# Altium project shkb_lite.PrjPcb
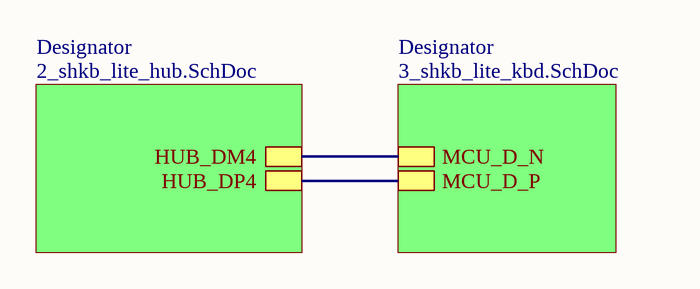
[diagram p0: 1_shkb_lite_top.SchDoc]
ProjectTitle: SHKB Lite; Revision: A3
3 sheets, 73 parts. Net scope: hierarchical (ports join the sheet entries above them; power ports are global).
Board file: shkb_lite.PcbDoc
Sheets:
  1_shkb_lite_top.SchDoc
    Designator = 2_shkb_lite_hub.SchDoc
    Designator = 3_shkb_lite_kbd.SchDoc

## Sheet 1_shkb_lite_top.SchDoc: =ProjectTitle
size A4; Address1: github.com/4pplet/SHKB; Address2: Licence: CERN-OHL-S; Revision: A3; SheetNumber: 1; SheetTotal: 3

### Sub-sheets
Designator = 2_shkb_lite_hub.SchDoc: HUB_DM4, HUB_DP4
Designator = 3_shkb_lite_kbd.SchDoc: MCU_D_P, MCU_D_N

### Nets
D4_N: sheet Designator/HUB_DM4, sheet Designator/MCU_D_N
D4_P: sheet Designator/HUB_DP4, sheet Designator/MCU_D_P

### Notes on the sheet
- Title
- Size:
- Date:
- A4
- Number:
- Time:
- Revision:
- Sheet
- of
- File:

## Sheet 2_shkb_lite_hub.SchDoc: =ProjectTitle
size A4; Address1: github.com/4pplet/SHKB; Address2: Licence: CERN-OHL-S; Revision: A3; SheetNumber: 2; SheetTotal: 7
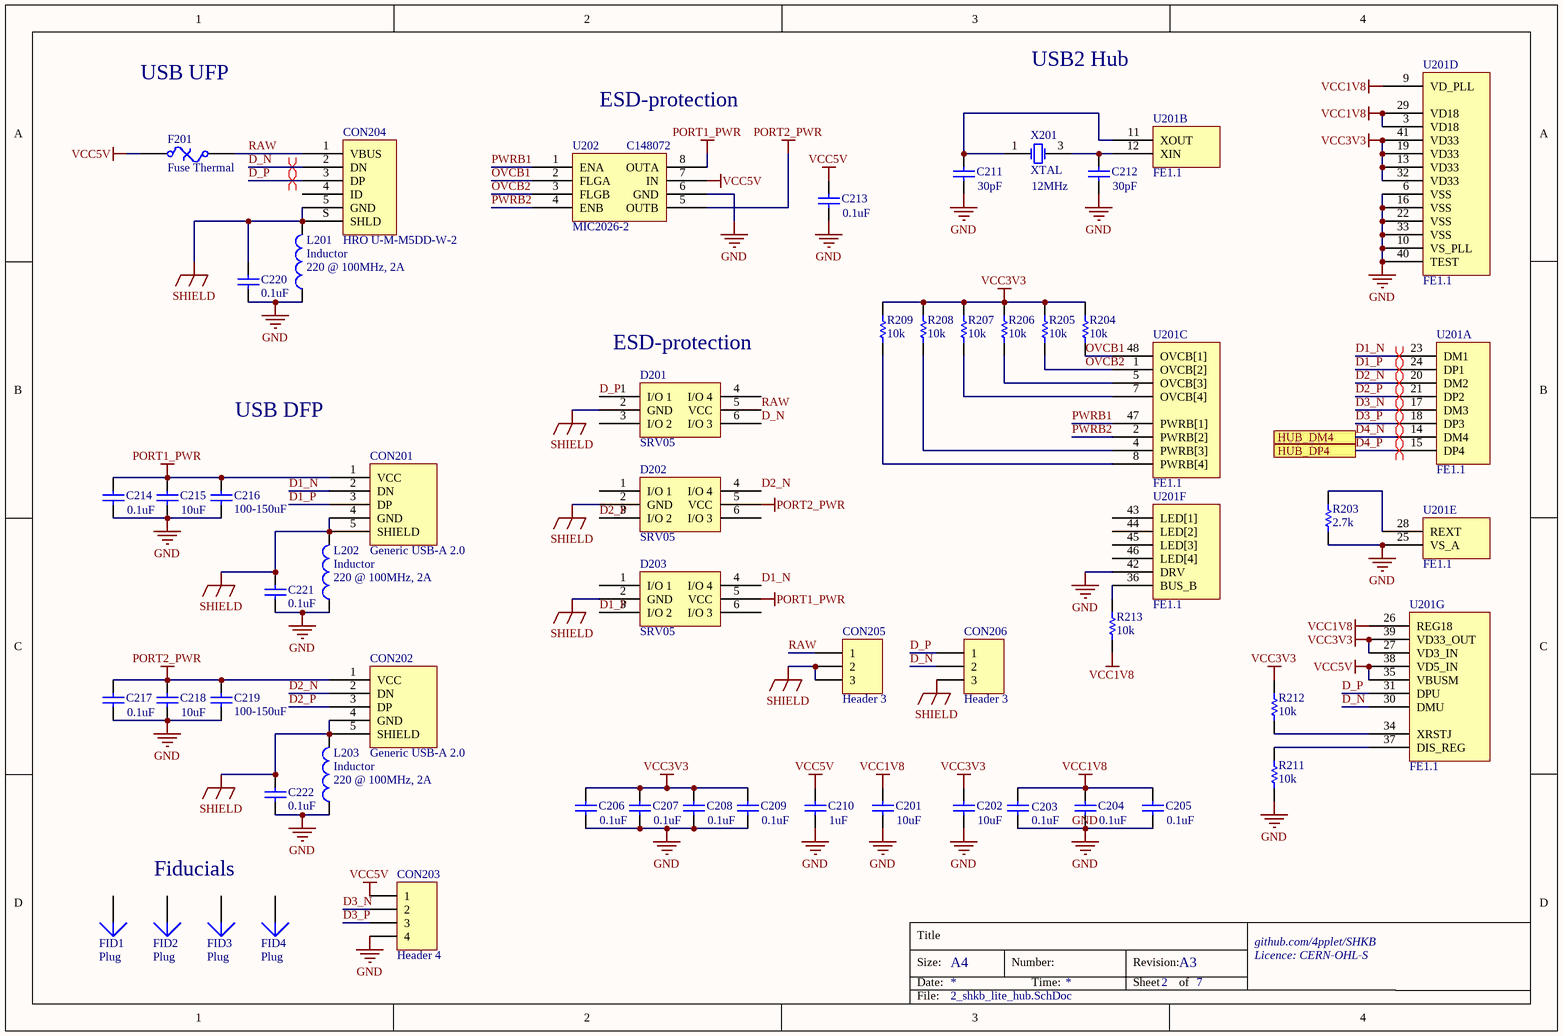
[diagram p1: 2_shkb_lite_hub.SchDoc]

### Parts
C201  value 10uF  [C0603[1608]]
C202  value 10uF  [C0603[1608]]
C203  value 0.1uF  [C0603[1608]]
C204  value 0.1uF  [C0603[1608]]
C205  value 0.1uF  [C0603[1608]]
C206  value 0.1uF  [C0603[1608]]
C207  value 0.1uF  [C0603[1608]]
C208  value 0.1uF  [C0603[1608]]
C209  value 0.1uF  [C0603[1608]]
C210  value 1uF  [C0603[1608]]
C211  value 30pF  [C0603[1608]]
C212  value 30pF  [C0603[1608]]
C213  value 0.1uF  [C0603[1608]]
C214  value 0.1uF  [C0603[1608]]
C215  value 10uF  [C0603[1608]]
C216  value 100-150uF  [C_9L_9M + THT]
C217  value 0.1uF  [C0603[1608]]
C218  value 10uF  [C0603[1608]]
C219  value 100-150uF  [C_9L_9M + THT]
C220  value 0.1uF  [C0603[1608]]
C221  value 0.1uF  [C0603[1608]]
C222  value 0.1uF  [C0603[1608]]
CON201  Generic USB-A 2.0  [Jing 903-231A2031S10100]
CON202  Generic USB-A 2.0  [Jing 903-231A2031S10100]
CON203  Header 4  [HDR1X4]  (no BOM)
CON204  HRO U-M-M5DD-W-2  [HRO U-M-M5DD-W-2]
CON205  Header 3  [HDR1X3]  (no BOM)
CON206  Header 3  [HDR1X3]  (no BOM)
D201  SRV05  [SOT-23-6]
D202  SRV05  [SOT-23-6]
D203  SRV05  [SOT-23-6]
F201  Fuse Thermal  [C1206[3216]]
FID1  Plug  [Fiducial_Nordic]  (no BOM)
FID2  Plug  [Fiducial_Nordic]  (no BOM)
FID3  Plug  [Fiducial_Nordic]  (no BOM)
FID4  Plug  [Fiducial_Nordic]  (no BOM)
L201  Inductor  value 220 @ 100MHz, 2A  [L0603[1608]]
L202  Inductor  value 220 @ 100MHz, 2A  [L0603[1608]]
L203  Inductor  value 220 @ 100MHz, 2A  [L0603[1608]]
R203  value 2.7k  [R0603[1608]]
R204  value 10k  [R0603[1608]]
R205  value 10k  [R0603[1608]]
R206  value 10k  [R0603[1608]]
R207  value 10k  [R0603[1608]]
R208  value 10k  [R0603[1608]]
R209  value 10k  [R0603[1608]]
R211  value 10k  [R0603[1608]]
R212  value 10k  [R0603[1608]]
R213  value 10k  [R0603[1608]]
U201  FE1.1  [FE1.1 LQFP48]  (parts A,B,C,D,E,F,G of 7)
U202  MIC2026-2  [SOIC-8]
X201  XTAL  value 12MHz  [XTAL-3225]

### Ports
HUB_DM4, HUB_DP4

### Nets
GND: C201.1 C202.1 C203.1 C204.1 C205.1 C206.1 C207.1 C208.1 C209.1 C210.1 C211.1 C212.1 C213.1 C214.1 C215.1 C216.2 C217.1 C218.1 C219.2 C220.1 C221.1 C222.1 CON203.4 L201.1 L202.1 L203.1 R203.1 R211.1 U201.6(VSS) U201.10(VS_PLL) U201.16(VSS) U201.22(VSS) U201.25(VS_A) U201.33(VSS) U201.40(TEST) U201.42(DRV) U202.6(GND) X201.2(GND) X201.4(GND)
PORT1_PWR: C214.2 C215.2 C216.1 CON201.1(VCC) D203.5(VCC) U202.8(OUTA)
PORT2_PWR: C217.2 C218.2 C219.1 CON202.1(VCC) D202.5(VCC) U202.5(OUTB)
SHIELD: C220.2 C221.2 C222.2 CON201.4(GND) CON201.5(SHIELD) CON202.4(GND) CON202.5(SHIELD) CON204.5(GND) CON204.S(SHLD) CON205.2 CON205.3 CON206.3 D201.2(GND) D202.2(GND) D203.2(GND) L201.2 L202.2 L203.2
VCC1V8: C201.2 C203.2 C204.2 C205.2 R213.1 U201.3(VD18) U201.9(VD_PLL) U201.26(REG18) U201.29(VD18)
VCC3V3: C202.2 C206.2 C207.2 C208.2 C209.2 R204.2 R205.2 R206.2 R207.2 R208.2 R209.2 R212.2 U201.13(VD33) U201.19(VD33) U201.27(VD3_IN) U201.32(VD33) U201.39(VD33_OUT) U201.41(VD33)
VCC5V: C210.2 C213.2 CON203.1 F201.1 U201.35(VBUSM) U201.38(VD5_IN) U202.7(IN)
D1_N: CON201.2(DN) D203.4(I/O_4) U201.23(DM1)
D1_P: CON201.3(DP) D203.3(I/O_2) U201.24(DP1)
D2_N: CON202.2(DN) D202.4(I/O_4) U201.20(DM2)
D2_P: CON202.3(DP) D202.3(I/O_2) U201.21(DP2)
D3_N: CON203.2 U201.17(DM3)
D3_P: CON203.3 U201.18(DP3)
D4_N: U201.14(DM4) ; port HUB_DM4
D4_P: U201.15(DP4) ; port HUB_DP4
D_N: CON204.2(DN) CON206.2 D201.6(I/O_3) U201.30(DMU)
D_P: CON204.3(DP) CON206.1 D201.1(I/O_1) U201.31(DPU)
OVCB1: R204.1 U201.48(OVCB[1]) U202.2(FLGA)
OVCB2: R205.1 U201.1(OVCB[2]) U202.3(FLGB)
PWRB1: U201.47(PWRB[1]) U202.1(ENA)
PWRB2: U201.2(PWRB[2]) U202.4(ENB)
RAW: CON204.1(VBUS) CON205.1 D201.5(VCC) F201.2
NetC211_2: C211.2 U201.11(XOUT) X201.1(OSC1)
NetC212_2: C212.2 U201.12(XIN) X201.3(OSC2)
NetR203_2: R203.2 U201.28(REXT)
NetR206_1: R206.1 U201.5(OVCB[3])
NetR207_1: R207.1 U201.7(OVCB[4])
NetR208_1: R208.1 U201.4(PWRB[3])
NetR209_1: R209.1 U201.8(PWRB[4])
NetR211_2: R211.2 U201.37(DIS_REG)
NetR212_1: R212.1 U201.34(XRSTJ)
NetR213_2: R213.2 U201.36(BUS_B)

Not connected (* = marked no-connect by the designer): CON204 4(ID); D201 3(I/O_2) 4(I/O_4); D202 1(I/O_1) 6(I/O_3); D203 1(I/O_1) 6(I/O_3); FID1 1; FID2 1; FID3 1; FID4 1; U201 43(LED[1]) 44(LED[2]) 45(LED[3]) 46(LED[4])

### Layout directives
differential pair: D1_N, D1_P, D2_N, D2_P, D3_N, D3_P, D4_N, D4_P, D_N, D_P

### Notes on the sheet
- USB UFP
- ESD-protection
- USB2 Hub
- (near U202) C148072
- (near D201) ESD-protection
- USB DFP
- Fiducials
- Title
- Size:
- Date:
- A4
- Number:
- Time:
- Revision:
- Sheet
- of
- File:

### Library data of the parts
C201 C202 C215 C218 = Cap: Capacitor; MRF.Part: CL10A106KP8NNNC; LCSC MFG: Samsung Electro-Mechanics; Version: 0603 imperial; JLC: BASIC; LCSC Part #: C19702
C203-C209 C213 C214 C217 C220-C222 = Cap: Capacitor; MRF.Part: CC0603KRX7R9BB104; MFG: KEMET; MFGPN: C0603C104M5RACTU; LCSC MFG: YAGEO; Version: 0603 imperial; JLC: BASIC; LCSC Part #: C14663
C210 = Cap: Capacitor; MRF.Part: CL10A105KB8NNNC; MFG: KEMET; MFGPN: C0603C105K4RACTU; LCSC MFG: Samsung Electro-Mechanics; Version: 0603 imperial; JLC: BASIC; LCSC Part #: C15849
C211 C212 = Cap: Capacitor; MRF.Part: 0603CG300J500NT; LCSC MFG: FH (Guangdong Fenghua Advanced Tech); Version: 0603 imperial; JLC: BASIC; LCSC Part #: C1658
C216 C219 = Cap: Capacitor; MRF.Part: OVZ101M1CTR-0606; LCSC MFG: Lelon; Version: SMD - 9L or 9M; JLC: EXTENDED; LCSC Part #: C134878
CON201 CON202 = Generic USB-A 2.0: MRF.Part: 903-231A2031S10100; LCSC MFG: Jing Extension of the Electronic Co.; JLC: EXTENDED; LCSC Part #: C42646
CON203 = Header 4: Header, 4-Pin
CON204 = HRO U-M-M5DD-W-2: LCSC MFG: Korean Hroparts Elec; LCSC Part #: C879746; MRF.Part: U-M-M5DD-W-2
CON205 CON206 = Header 3: Header, 3-Pin
D201-D203 = SRV05: MRF.Part: SRV05-4-P-T7; LCSC MFG: ProTek Devices; LCSC Part #: C85364; JLC: BASIC
F201 = Fuse Thermal: Thermal Fuse; MRF.Part: ASMD1206-050; MFG: Bel Fuse Inc.; MFGPN: 0ZCJ0050FF2G; LCSC MFG: Shenzhen JDT Fuse; LCSC Part #: C135338
L201-L203 = Inductor: MRF.Part: BLM18KG331SN1D; MFG: Murata Electronics North America; MFGPN: BLM18KG221SN1D; LCSC MFG: Murata Electronics; Version: 0603 imperial; JLC: EXTENDED; LCSC Part #: C85832
R203 = Res1: Resistor; MRF.Part: 0603WAF2701T5E; LCSC MFG: UNI-ROYAL(Uniroyal Elec); Version: 0603 imperial; JLC: BASIC; LCSC Part #: C13167
R204-R209 R211-R213 = Res1: Resistor; MRF.Part: 0603WAF1002T5E; MFG: Vishay Dale; MFGPN: RCA060310K0FKEA; LCSC MFG: Uniroyal Elec; Version: 0603 imperial; JLC: BASIC; LCSC Part #: C25804
U201 = FE1.1: LCSC MFG: Terminus Tech; JLC: EXTENDED; LCSC Part #: C28958; MRF.Part: FE1.1
U202 = MIC2026-2: MRF.Part: MIC2026-2YM-TR; LCSC MFG: Microchip Tech; JLC: EXTENDED; LCSC Part #: C148072
X201 = XTAL: Crystal Oscillator; MRF.Part: X322512MSB4SI; LCSC MFG: Yangxing Tech; LCSC Part #: C9002; JLC: BASIC
FID1-FID4 = Plug: JLC: DNP

## Sheet 3_shkb_lite_kbd.SchDoc: =ProjectTitle
size A4; Address1: github.com/4pplet/SHKB; Address2: Licence: CERN-OHL-S; Revision: A3; SheetNumber: 3; SheetTotal: 3
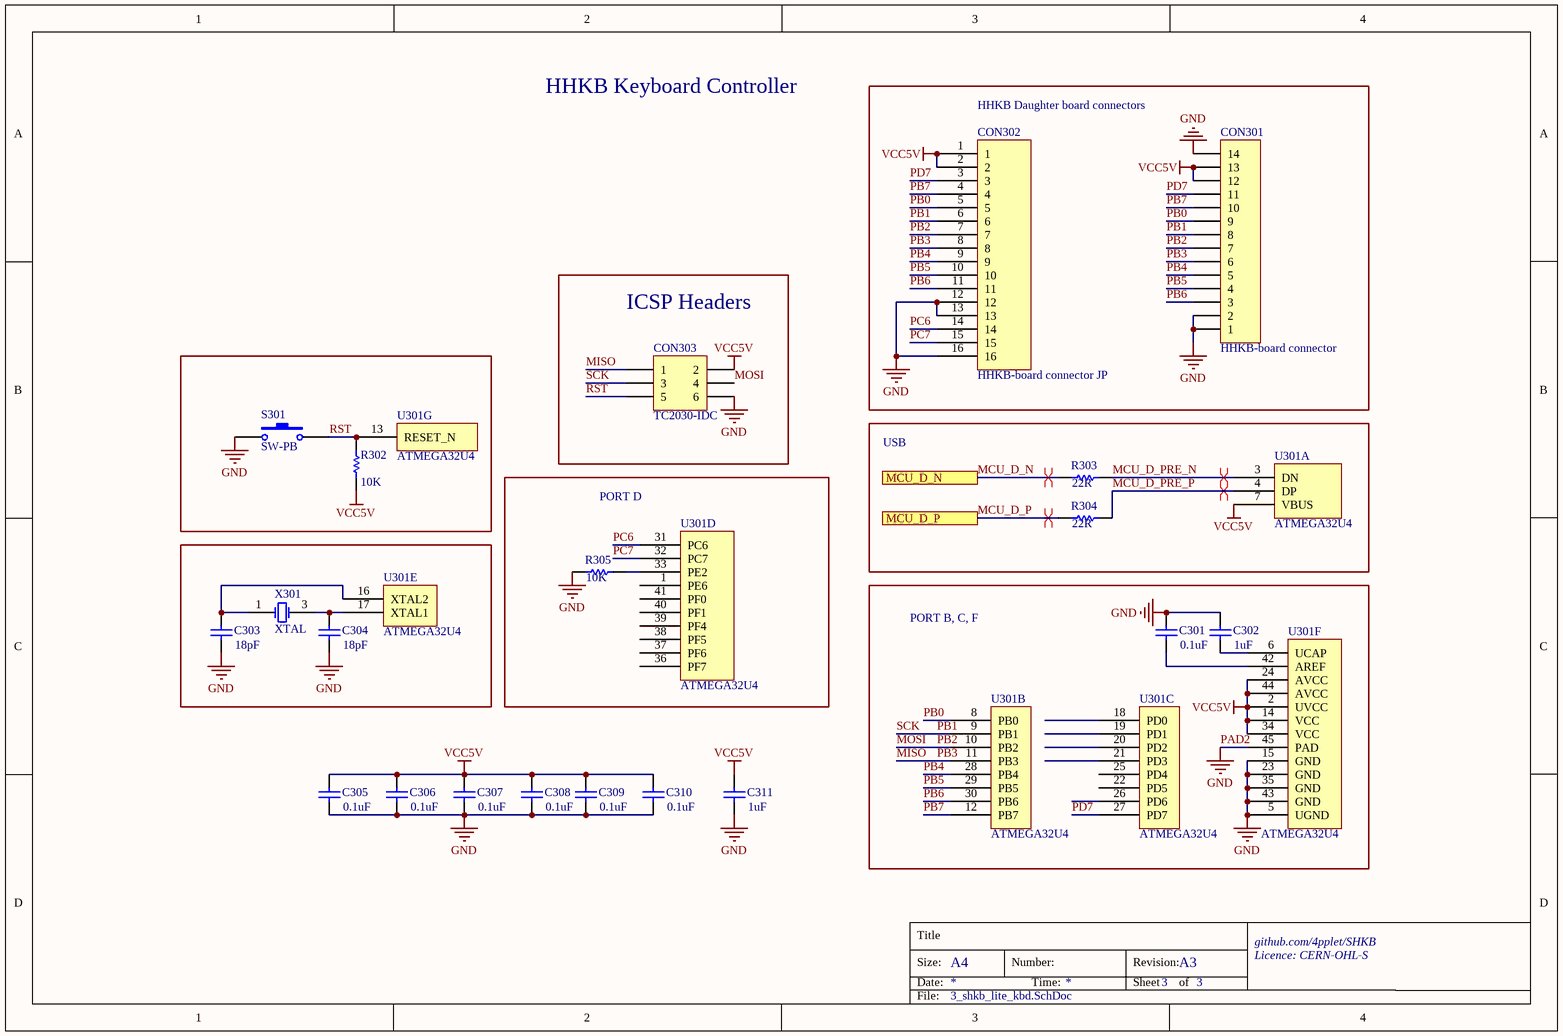
[diagram p2: 3_shkb_lite_kbd.SchDoc]

### Parts
C301  value 0.1uF  [C0603[1608]]
C302  value 1uF  [C0603[1608]]
C303  value 18pF  [C0603[1608]]
C304  value 18pF  [C0603[1608]]
C305  value 0.1uF  [C0603[1608]]
C306  value 0.1uF  [C0603[1608]]
C307  value 0.1uF  [C0603[1608]]
C308  value 0.1uF  [C0603[1608]]
C309  value 0.1uF  [C0603[1608]]
C310  value 0.1uF  [C0603[1608]]
C311  value 1uF  [C0603[1608]]
CON301  HHKB-board connector  [JST S13B-ZR-SM4A-TF(LF)(SN)]
CON302  HHKB-board connector JP  [DF14A-15P-1.25H]  (no BOM)
CON303  TC2030-IDC  [TC2030-IDC-NL]  (no BOM)
R302  value 10K  [R0603[1608]]
R303  value 22R  [R0603[1608]]
R304  value 22R  [R0603[1608]]
R305  value 10K  [R0603[1608]]
S301  SW-PB  [Wurth 431256038736]
U301  ATMEGA32U4  [ATMEGA32U4-COMBO]  (parts A,B,C,D,E,F,G of 7)
X301  XTAL  [XTAL-3225]

### Blocks framed on the sheet
HHKB Daughter board connectors: CON301 CON302
ICSP Headers: CON303
USB: R303 R304 U301
PORT D: R305 U301
PORT B, C, F: C301 C302 U301

### Ports
MCU_D_N, MCU_D_P

### Nets
GND: C301.2 C302.2 C303.1 C304.1 C305.1 C306.1 C307.1 C308.1 C309.1 C310.1 C311.1 CON301.1 CON301.2 CON301.14 CON302.12 CON302.13 CON302.16 CON303.6 R305.1 S301.2 S301.3(GND) U301.5(UGND) U301.15(GND) U301.23(GND) U301.35(GND) U301.43(GND) U301.45(PAD) X301.2(GND) X301.4(GND)  [also labelled PAD2]
VCC5V: C305.2 C306.2 C307.2 C308.2 C309.2 C310.2 C311.2 CON301.12 CON301.13 CON302.1 CON302.2 CON303.2 R302.2 U301.2(UVCC) U301.7(VBUS) U301.14(VCC) U301.24(AVCC) U301.34(VCC) U301.44(AVCC)
MCU_D_N: R303.1 ; port MCU_D_N  [project net D4_N]
MCU_D_P: R304.1 ; port MCU_D_P  [project net D4_P]
MCU_D_PRE_N: R303.2 U301.3(DN)
MCU_D_PRE_P: R304.2 U301.4(DP)
MISO: CON301.6 CON302.8 CON303.1 U301.11(PB3)  [also labelled PB3]
MOSI: CON301.7 CON302.7 CON303.4 U301.10(PB2)  [also labelled PB2]
PB0: CON301.9 CON302.5 U301.8(PB0)
PB1: CON301.8 CON302.6 CON303.3 U301.9(PB1)  [also labelled SCK]
PB4: CON301.5 CON302.9 U301.28(PB4)
PB5: CON301.4 CON302.10 U301.29(PB5)
PB6: CON301.3 CON302.11 U301.30(PB6)
PB7: CON301.10 CON302.4 U301.12(PB7)
PC6: CON302.14 U301.31(PC6)
PC7: CON302.15 U301.32(PC7)
PD7: CON301.11 CON302.3 U301.27(PD7)
RST: CON303.5 R302.1 S301.1 U301.13(RESET_N)
NetC301_1: C301.1 U301.42(AREF)
NetC302_1: C302.1 U301.6(UCAP)
NetC303_2: C303.2 U301.16(XTAL2) X301.1(OSC1)
NetC304_2: C304.2 U301.17(XTAL1) X301.3(OSC2)
NetR305_2: R305.2 U301.33(PE2)

Not connected (* = marked no-connect by the designer): U301 1(PE6) 18(PD0) 19(PD1) 20(PD2) 21(PD3) 22(PD5) 25(PD4) 26(PD6) 36(PF7) 37(PF6) 38(PF5) 39(PF4) 40(PF1) 41(PF0)

### Layout directives
differential pair: D4_N, D4_P, MCU_D_PRE_N, MCU_D_PRE_P

### Notes on the sheet
- HHKB Keyboard Controller
- Title
- Size:
- Date:
- A4
- Number:
- Time:
- Revision:
- Sheet
- of
- File:

### Library data of the parts
C301 C305-C310 = Cap: as C203 on sheet 2_shkb_lite_hub; Version: 0603 imperial; JLC: BASIC; LCSC Part #: C14663
C302 C311 = Cap: as C210 on sheet 2_shkb_lite_hub; Version: 0603 imperial; JLC: BASIC; LCSC Part #: C15849
C303 C304 = Cap: Capacitor; MRF.Part: CL10C180JB8NNNC; MFG: KEMET; MFGPN: C0603C180J5GACAUTO; LCSC MFG: Samsung Electro-Mechanics; Version: 0603 imperial; JLC: BASIC; LCSC Part #: C1647
CON301 = Header 14: MFGPN: S13B-ZR-SM4A-TF(LF)(SN); MFG: JST Sales America Inc; LCSC MFG: JST Sales America; JLC: NONE; LCSC Part #: C265326; MRF.Part: S13B-ZR-SM4A-TF(LF)(SN)
CON302 = DF14A-15P-1.25H: MFG: Hirose Electric Co Ltd; MFGPN: DF14A-15P-1.25H(26); LCSC MFG: HRS(Hirose); JLC: NONE; LCSC Part #: C597889; MRF.Part: DF14A-15P-1.25H(26)
CON303 = Header 3X2: Header, 3-Pin, Dual row; JLC: DNP
R302 R305 = Res1: as R204 on sheet 2_shkb_lite_hub; Version: 0603 imperial; JLC: BASIC; LCSC Part #: C25804
R303 R304 = Res1: Resistor; MRF.Part: 0603WAF220JT5E  0603WAF220JT5E; MFG: Vishay Dale; MFGPN: CRCW060322R0FKEAC; LCSC MFG: Uniroyal Elec; Version: 0603 imperial; JLC: BASIC; LCSC Part #: C23345
S301 = SW-PB: Switch; MRF.Part: K2-1102AQ-C4CW-01; MFGPN: 431256038736; MFG: Wurth Electronics Inc; LCSC MFG: Korean Hroparts Elec; LCSC Part #: C127680; JLC: NONE
U301 = ATMEGA32U4: MFG: Microchip Technology; MFGPN: ATMEGA32U4-MUR; LCSC MFG: Microchip Tech; LCSC Part #: C45874; MRF.Part: ATMEGA32U4-MUR; JLC: EXTENDED
X301 = XTAL: Crystal Oscillator; MRF.Part: X322516MLB4SI; LCSC MFG: Yangxing Tech; LCSC Part #: C13738; JLC: BASIC

## Nets that join several sheets
GND: 2_shkb_lite_hub (39 pins), 3_shkb_lite_kbd (29 pins)
VCC5V: 2_shkb_lite_hub (7 pins), 3_shkb_lite_kbd (19 pins)
D4_N: 2_shkb_lite_hub (U201.14), 3_shkb_lite_kbd (R303.1)
D4_P: 2_shkb_lite_hub (U201.15), 3_shkb_lite_kbd (R304.1)